# EAGLE design TEMP(TMP007_I2C_V2) (EAGLE 6.5.0)
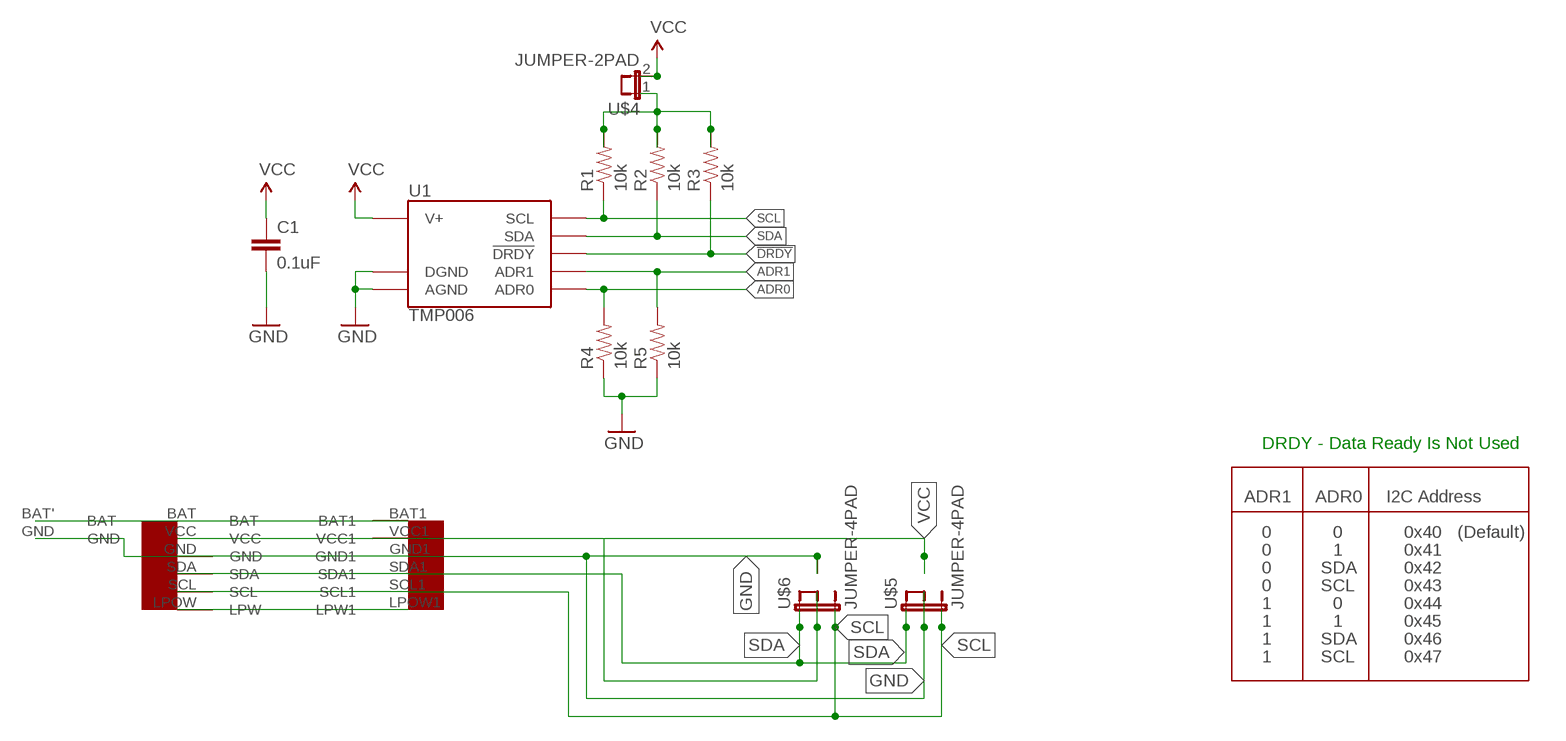
[diagram p0: schematic, sheet 1]

## Parts
C1  0.1uF  CAP0603-CAP  [0603-CAP]
R1  10k  RESISTOR0603-RES  [0603-RES]
R2  10k  RESISTOR0603-RES  [0603-RES]
R3  10k  RESISTOR0603-RES  [0603-RES]
R4  10k  RESISTOR0603-RES  [0603-RES]
R5  10k  RESISTOR0603-RES  [0603-RES]
U1  TMP006  [BGA8DS]
U$1  EZ-I2CHEADERV1  [EZ-I2CHEADERV1]
U$3  MINI_BATTERY_HOLES  [MINI_BATTERY_HOLES]
U$4  JUMPER-2PAD  [JUMPER-2PAD]
U$5  JUMPER-4PAD  [JUMPER-4PAD]
U$6  JUMPER-4PAD  [JUMPER-4PAD]

## Nets
!DRDY: R3.1 U1.C2(!DRDY)
ADR0: R4.2 U1.C1(ADR0)
ADR1: R5.2 U1.B1(ADR1)
GND: C1.2 R4.1 R5.1 U1.A1(DGND) U1.A2(AGND) U$1.GND U$1.GND1 U$3.GND U$5.2 U$6.4
N$1: U$1.BAT U$1.BAT1 U$3.BAT'(BAT)
N$2: U$1.LPOW1(LPW1) U$1.LPOW(LPW)
N$3: R1.2 R2.2 R3.2 U$4.1
SCL: R1.1 U1.B3(SCL) U$1.SCL U$1.SCL1 U$5.3 U$6.3
SDA: R2.1 U1.C3(SDA) U$1.SDA U$1.SDA1 U$5.1 U$6.1
VCC: C1.1 U1.A3(V+) U$1.VCC U$1.VCC1 U$4.2 U$5.4 U$6.2

## Notes on the sheet
- DRDY - Data Ready Is Not Used
- ADR1 | ADR0 | I2C Address
- 0 | 0 | 0x40 | (Default)
- 0 | 1 | 0x41
- 0 | SDA | 0x42
- 0 | SCL | 0x43
- 1 | 0 | 0x44
- 1 | 1 | 0x45
- 1 | SDA | 0x46
- 1 | SCL | 0x47

## Library data of the parts
C1 = SparkFun-Capacitors:CAP: Capacitor Standard 0603 ceramic capacitor, and 0.1" leaded capacitor.
R1-R5 = SparkFun-Resistors:RESISTOR: Resistor Basic schematic elements and footprints for 0603, 1206, and PTH resistors.
U1 = SparkFun-DigitalIC:TMP006
U$1 = UniqueInteractionsLib:EZ-I2CHEADERV1
U$3 = UniqueInteractionsLib:MINI_BATTERY_HOLES
U$4 = UniqueInteractionsLib:JUMPER-2PAD
U$5 U$6 = UniqueInteractionsLib:JUMPER-4PAD

## Board
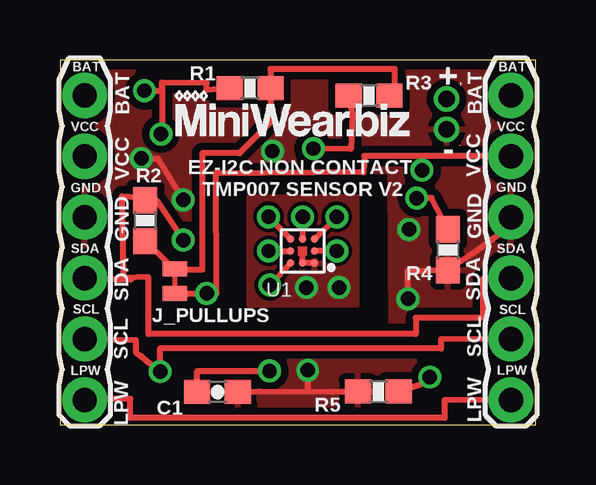
[diagram p1: board, top side]
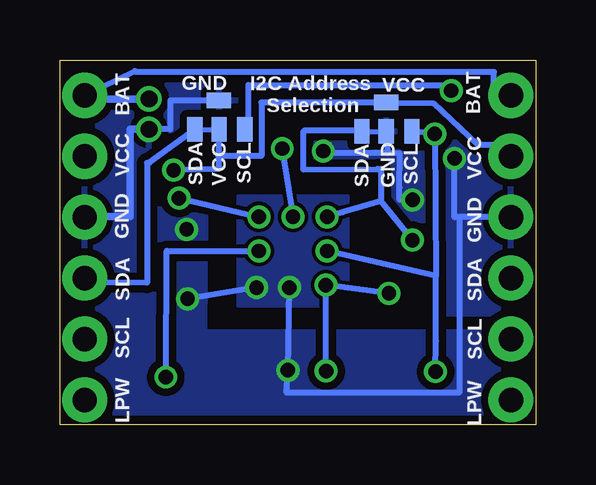
[diagram p2: board, bottom side, seen from below]

Size 19.84 x 15.21 mm. Coordinates in mm from the lower left corner, seen from the top.
Outline: 0,15.21 0,0 19.84,0 19.84,15.21 0,15.21
Copper layers (1*16): Top 0.0356mm / dielectric 1.5011mm / Bottom 0.0356mm
Design rules "oshParkPCBDesignRules": minimum track width 6mil, minimum drill 13mil, track to track 6mil, track to pad 6mil, pad to pad 6mil, via to via 6mil, smd to smd 6mil, copper to edge 15mil, drill to drill 6mil, minimum pad ring 7mil, minimum via ring 7mil, stop-mask expansion 3mil, vias tented up to drill 0mil, thermal gap 10mil

### Footprints (pad centres in the part's own frame; a part is rotated, then mirrored left to right if it is on the bottom)
0603-CAP = smd 1.1 x 1: 1 -0.85,0; 2 0.85,0
0603-RES = smd 1.1 x 1: 1 -0.85,0; 2 0.85,0
BGA8DS = smd 0.305 x 0.305: A1 0.5,-0.5; A2 0,-0.5; A3 -0.5,-0.5; B1 0.5,0; B3 -0.5,0; C1 0.5,0.5; C2 0,0.5; C3 -0.5,0.5
EZ-I2CHEADERV1 = drill 1.016 pad 1.88: BAT 0,-1.27; BAT1 17.78,-1.27; GND 0,-6.35; GND1 17.78,-6.35; LPOW 0,-13.97; LPOW1 17.78,-13.97; SCL 0,-11.43; SCL1 17.78,-11.43; SDA 0,-8.89; SDA1 17.78,-8.89; VCC 0,-3.81; VCC1 17.78,-3.81
MINI_BATTERY_HOLES = drill 0.7 pad 1.016: BAT' 0.435,3.175; GND 0.435,1.905
JUMPER-2PAD = smd 0.635 x 1.016: 1 -0.508,0; 2 0.508,0
JUMPER-4PAD = smd 0.635 x 1.016: 1 -0.508,0; 2 0.508,0; 3 1.578,0 | smd 1.016 x 0.635: 4 0.5,1.208

### Placement (x,y rotation side)
C1  6.57,1.36 0 top
R1  7.93,14.03 0 top
R2  3.55,8.51 270 top
R3  12.89,13.72 0 top
R4  16.18,7.29 90 top
R5  13.28,1.38 0 top
U1  10.12,7.24 0 top
U$1  1.03,15 0 top
U$2  [LOGO2]  4.71,11.85 0 top
U$3  15.69,10.41 0 top
U$4  4.79,5.98 270 top
U$5  6.74,12.23 0 bottom
U$6  13.71,12.31 0 bottom

### Tracks (layer width: path | path; a pad name or v marks a point on that pad's centre or on a via)
!DRDY  (via drill 0.6 pad 0.25)
  Top 0.254: R3.1 12.19,12.94 12.13,11.5 v10.57,11.51 | v10.12,8.66 U1.C2
  Bottom 0.254: v10.57,11.51 v10.12,8.66
ADR0  (via drill 0.6 pad 0.25)
  Top 0.254: R4.2 15.5,9.45 v14.88,9.44 | v11.54,8.66 U1.C1
  Bottom 0.254: v14.88,9.44 v11.54,8.66
ADR1  (via drill 0.6 pad 0.25)
  Top 0.254: R5.2 15.39,1.8 v15.42,1.98 | v11.54,7.24 U1.B1
  Bottom 0.254: v15.42,1.98 15.39,7.25 v11.54,7.24
GND  (via drill 0.6, 0.6 pad 0.25)
  Top 0.254: 10.35,1.39 11.37,1.37 R5.1 | C1.2 10.35,1.39 | 10.35,1.39 v10.33,2.27 | v10.27,5.72 10.27,5.97 | v14.52,5.25 14.51,6.41 R4.1 17.27,7.17 18.69,8.23 18.8,8.51 U$1.GND1 | U1.A1 U1.A2 10.12,7.18 | v3.39,11.1 4.08,11.1 v5.14,9.37
  Bottom 0.254: v10.27,5.72 v10.33,2.27 10.38,1.33 3.19,1.33 3.19,8.65 | v11.64,5.72 v14.52,5.25 | U$1.GND 3.19,8.65 | U$6.4 15.24,13.52 15.24,12.32 U$3.GND | U$5.2 6.19,11.32 | 6.19,11.32 7.39,11.33 8.82,11.33 v8.86,11.41 | 3.19,8.65 3.39,8.65 v3.39,11.1 | v5.14,9.37 5.68,9.37 5.68,9.87 5.67,11.31 6.19,11.32
  Bottom 0.305: U$3.GND 16.92,12.32 16.92,8.67 18.81,8.67 U$1.GND1
  other vias: 14.56,8.14
  pour Top: 7.83,4.95 7.83,9.53 12.41,9.53 12.41,4.95
  pour Top (isolate 0.305): 0.43,3.86 0.33,-0.1 20.48,-0.1 20.39,16.01 0.24,16.01 0.23,4.61 6.68,4.61 6.65,10.6 13.77,10.55 13.8,3.81
  pour Bottom (isolate 0.305): 0.43,3.86 0.33,-0.1 20.48,-0.1 20.38,16.1 0.23,16.1 0.23,4.61 6.68,4.61 6.61,10.62 13.76,10.64 13.83,3.88
  pour Bottom: 7.83,9.53 12.41,9.53 12.41,4.95 7.83,4.95
N$1
  Bottom 0.254: U$1.BAT 1.77,13.76 1.74,14.71 16.68,14.71 16.71,14.75 U$1.BAT1
  Bottom 0.305: U$3.BAT' 18.81,13.59 U$1.BAT1
N$2
  Top 0.254: U$1.LPOW1 16.04,1.02 16.04,0.28 2.93,0.28 2.93,1.08 1.49,1.08 U$1.LPOW
N$3
  Top 0.254: R2.2 4.46,6.76 U$4.1 4.79,6.46 5.93,6.46 5.93,11.32 7.49,11.32 8.78,12.61 R1.2 8.78,14.83 13.96,14.83 13.96,13.86 R3.2
SCL  (via drill 0.6, 0.6 pad 0.25)
  Top 0.254: R1.1 6.12,13.95 6.12,14.25 4.26,14.27 | 4.26,14.27 4.27,12.66 v4.21,12.12 | v8.7,7.24 U1.B3 | U$1.SCL1 15.89,3.56 15.89,3.17 4.16,3.17 v4.18,2.21 3.39,2.85 3.16,3.02 3.16,3.53 U$1.SCL | v3.52,13.93 4.26,13.93 4.26,14.27
  Bottom 0.254: 4.16,6.21 v4.21,12.12 4.33,12.19 U$5.3 | 4.16,6.21 v8.7,7.24 | v4.18,2.21 4.16,3.49 4.16,6.21 | U$6.3 11.98,12.31 11.98,14.16 3.52,14.16 v3.52,13.93
SDA  (via drill 0.6 pad 0.25)
  Top 0.254: v5.14,7.69 4.04,9.33 R2.1 3.95,9.44 2.59,9.53 2.65,6.11 | v8.7,8.66 U1.C3 | 2.65,6.11 2.95,6.05 U$1.SDA | 17.64,6.09 17.63,4.46 14.84,4.46 14.84,3.78 3.69,3.78 3.69,6.15 2.65,6.11 | U$1.SDA1 17.64,6.09 | 17.64,6.09 17.83,6.09
  Bottom 0.254: v5.14,7.69 6.45,9.33 | 6.45,9.33 8.04,8.86 v8.7,8.66 | U$5.1 7.16,12.27 9.64,12.27 9.7,12.21 9.7,10.64 6.59,10.65 6.59,10.66 6.46,10.66 6.45,9.33 | U$6.1 16.12,10.92 16.21,10.91 16.21,5.91 18.81,5.92 U$1.SDA1
VCC  (via drill 0.6, 0.6 pad 0.25)
  Top 0.254: v8.75,5.82 U1.A3 | C1.1 5.72,2.23 v8.74,2.23 | U$1.VCC1 15.07,11.21 | 15.07,11.21 14.9,11.21 12.69,11.21 12.66,10.53 6.51,10.48 6.54,5.47 v6.12,5.48 v6.12,5.47 U$4.2 | v15.1,10.61 15.07,11.21
  Bottom 0.254: v6.12,5.48 v8.75,5.82 v8.74,2.23 | U$1.VCC 1.52,11.68 2.43,11.68 4.27,13.4 U$5.4 11.44,13.44 11.44,11.2 13.23,11.2 | U$6.2 13.23,12.31 13.23,11.2 | v15.1,10.61 13.23,10.66 13.23,11.08 13.23,11.2

### Text on the board
tNames: + | - | EZ-I2C NON CONTACT / TMP007 SENSOR V2 | J_PULLUPS
bNames: VCC | I2C Address / Selection | GND | SCL | GND | SDA | SCL | VCC | SDA